# Altium project Pixel1.0_2.PrjPcb
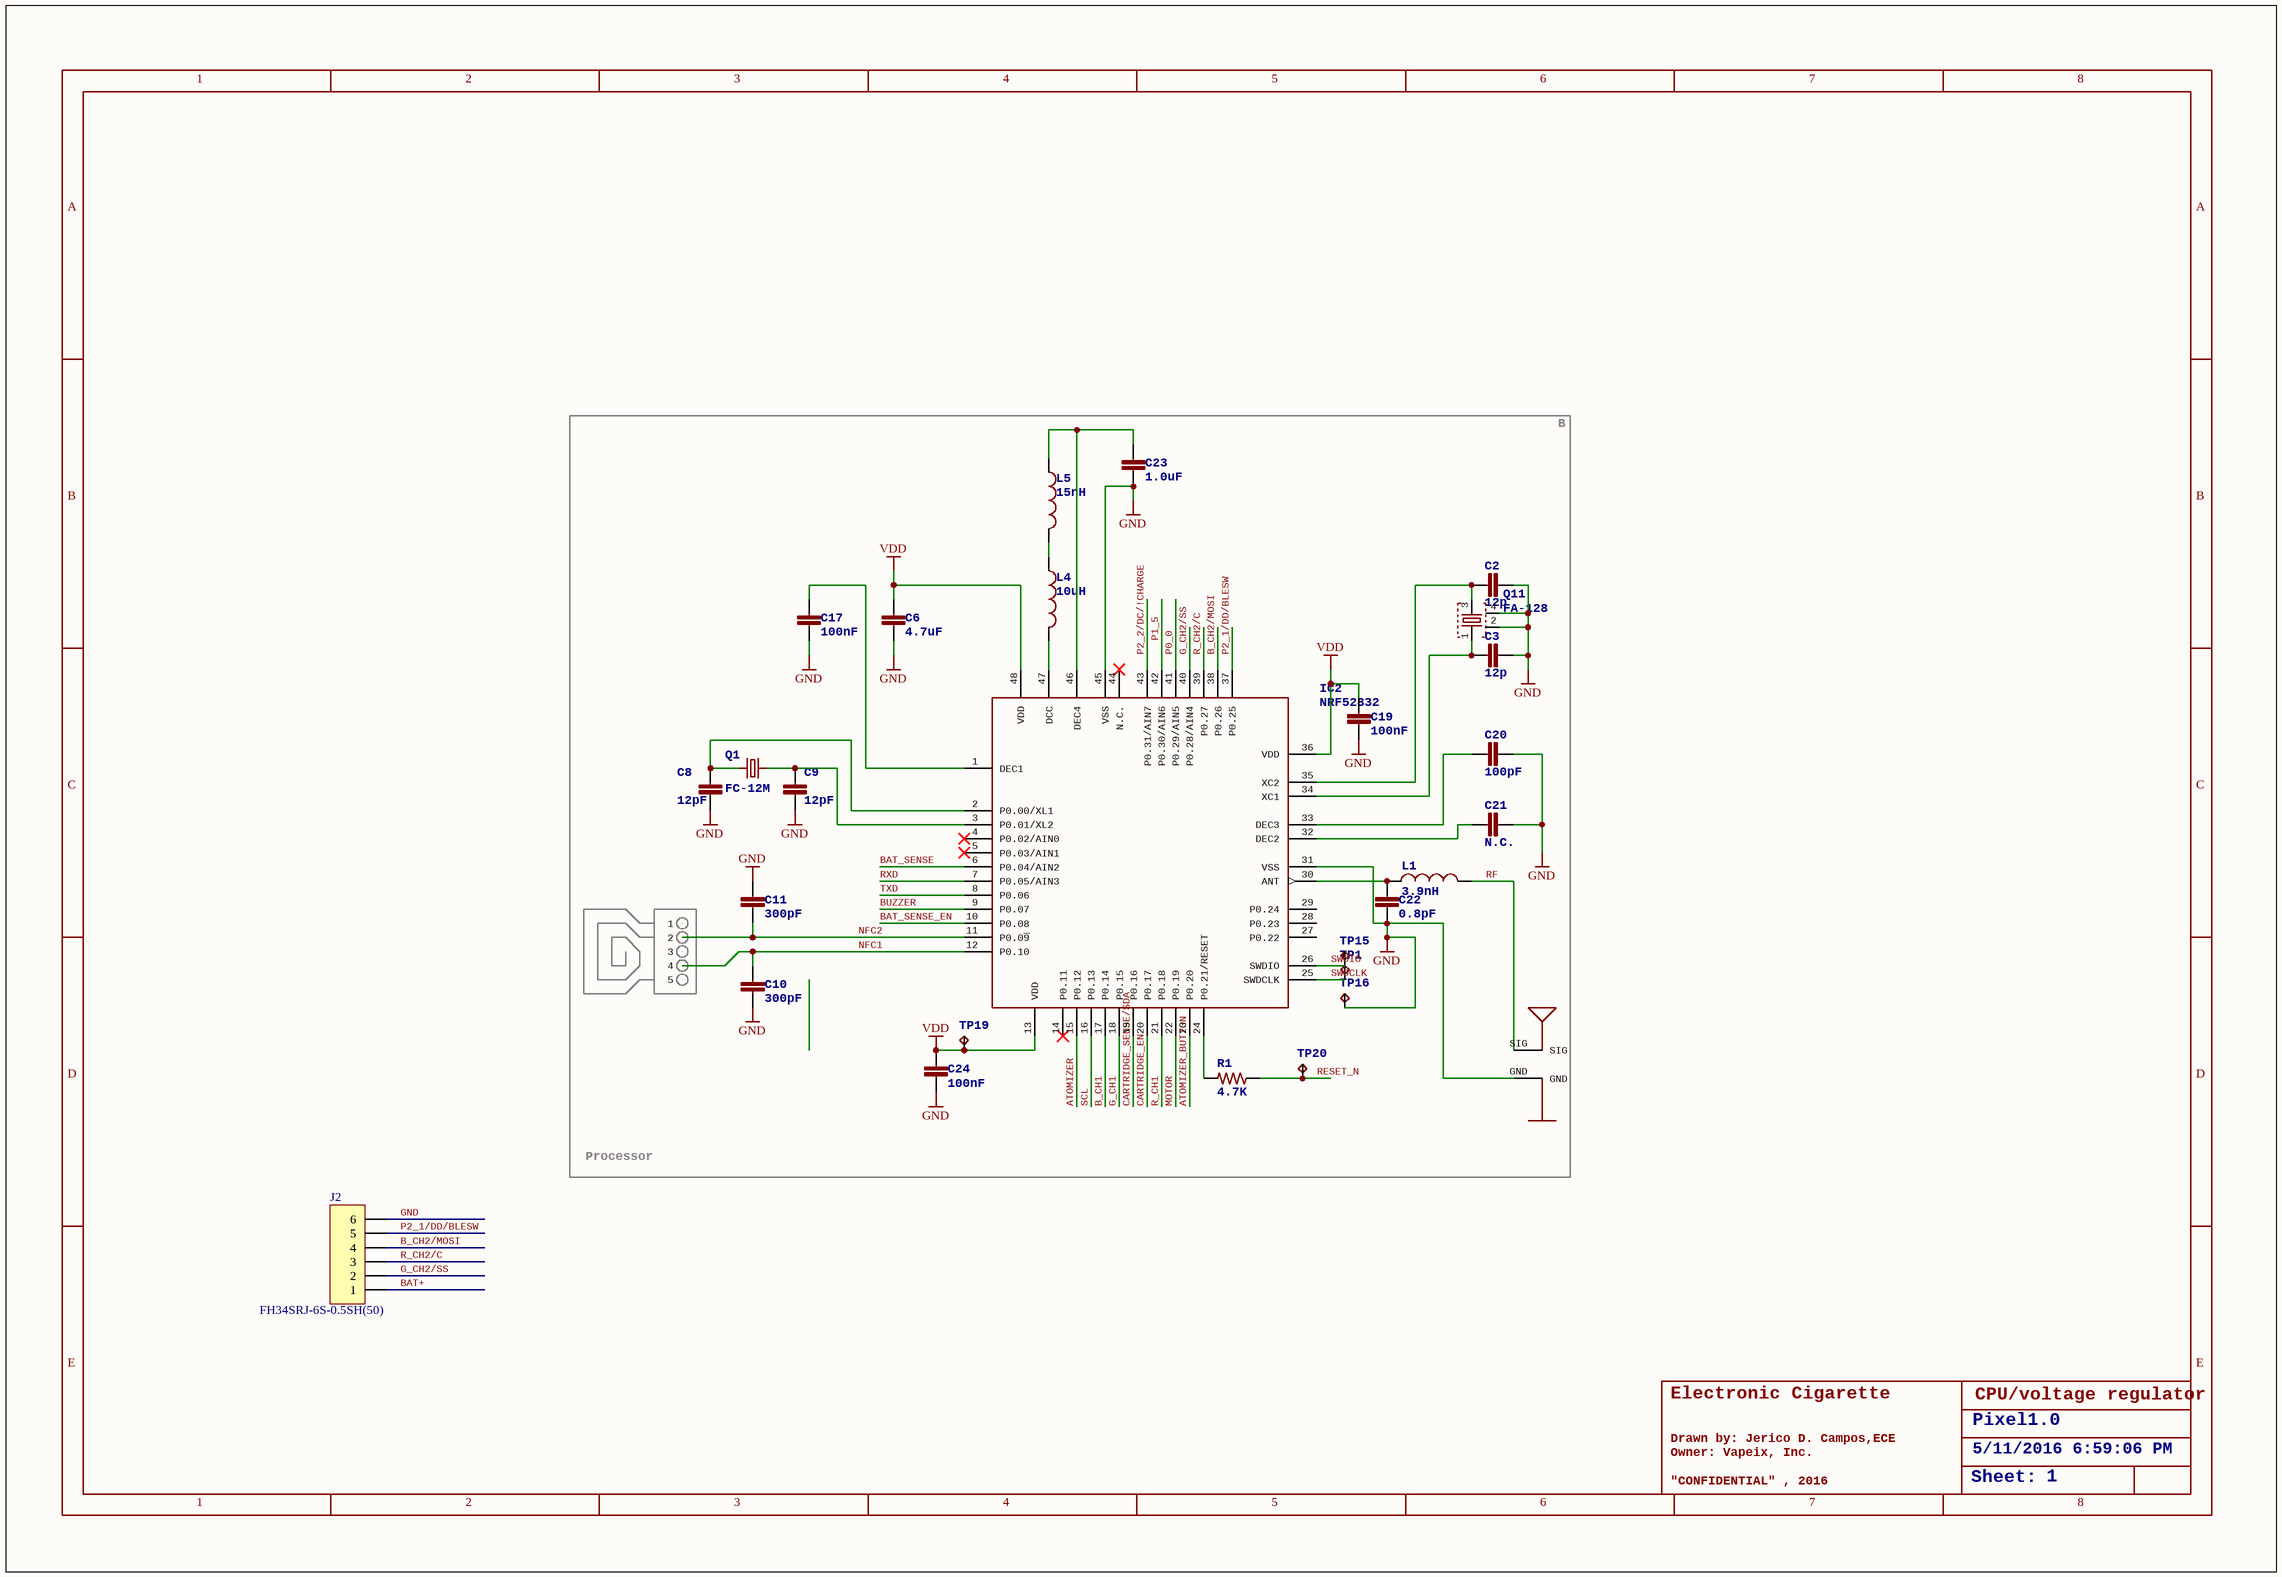
[diagram p0: Pixel1.0_0.SchDoc]
2 sheets, 82 parts. Net scope: global (net labels, ports and power ports of the same name join across sheets).
Board file: Pixel1.0_2.PcbDoc
Sheets:
  Pixel1.0_0.SchDoc
  Pixel1.0_2.SchDoc

## Sheet Pixel1.0_0.SchDoc: Pixel1.0
size 409 x 282 mm; Date: 5/11/2016 6:59:06 PM; SheetNumber: 1

### Parts
ANT  U.FL  [U.FL]  (value not drawn)
C2  12p  [C0201]
C3  12p  [C0201]
C6  4.7uF  [C0201]
C8  12pF  [C0201]
C9  12pF  [C0201]
C10  300pF  [C0201]
C11  300pF  [C0201]
C17  100nF  [C0201]
C19  100nF  [C0201]
C20  100pF  [C0201]
C21  N.C.  [C0201]
C22  0.8pF  [C0201]
C23  1.0uF  [C0201]
C24  100nF  [C0201]
IC2  NRF52832  [QFN-48]
J2  FH34SRJ-6S-0.5SH(50)  [59453061110ECHLF]
L1  3.9nH  [JE0402]
L4  10uH  [C0603]
L5  15nH  [JE0402]
Q1  FC-12M  [FC-12M]
Q11  FA-128  [FA-128]
R1  4.7K  [R0201]
TP1  TPTP06R  [TP06R]  (value not drawn)
TP15  TPTP06R  [TP06R]  (value not drawn)
TP16  TPTP06R  [TP06R]  (value not drawn)
TP19  TPTP06R  [TP06R]  (value not drawn)
TP20  TPTP06R  [TP06R]  (value not drawn)
U$2  NFCCONNECTORMOLEX_5PIN  [NFC.CONN]  (value not drawn)

### Nets
GND: ANT.GND C2.2 C3.1 C6.2 C8.2 C9.2 C10.2 C11.2 C17.2 C19.2 C20.1 C21.1 C22.2 C23.2 C24.2 IC2.31(VSS) IC2.45(VSS) J2.6 Q11.2 Q11.4 TP16.TP
VDD: C6.1 C19.1 C24.1 IC2.13(VDD) IC2.36(VDD) IC2.48(VDD) TP19.TP
ATOMIZER: IC2.15(P0.12)
ATOMIZER_BUTTON: IC2.23(P0.20)
B_CH1: IC2.17(P0.14)
B_CH2/MOSI: IC2.38(P0.26) J2.4
BAT+: J2.1
BAT_SENSE: IC2.6(P0.04/AIN2)
BAT_SENSE_EN: IC2.10(P0.08)
BUZZER: IC2.9(P0.07)
CARTRIDGE_EN: IC2.20(P0.17)
CARTRIDGE_SENSE/SDA: IC2.19(P0.16)
G_CH1: IC2.18(P0.15)
G_CH2/SS: IC2.40(P0.28/AIN4) J2.2
MOTOR: IC2.22(P0.19)
NFC1: C10.1 IC2.12(P0.10) U$2.4
NFC2: C11.1 IC2.11(P0.0~{9}) U$2.2
P0_0: IC2.41(P0.29/AIN5)
P1_5: IC2.42(P0.30/AIN6)
P2_1/DD/BLESW: IC2.37(P0.25) J2.5
P2_2/DC/!CHARGE: IC2.43(P0.31/AIN7)
R_CH1: IC2.21(P0.18)
R_CH2/C: IC2.39(P0.27) J2.3
RESET_N: R1.1 TP20.TP
RF: ANT.SIG L1.2
RXD: IC2.7(P0.05/AIN3)
SCL: IC2.16(P0.13)
SWDCLK: IC2.25(SWDCLK) TP1.TP
SWDIO: IC2.26(SWDIO) TP15.TP
TXD: IC2.8(P0.06)
NetC2_1: C2.1 IC2.35(XC2) Q11.3
NetC3_2: C3.2 IC2.34(XC1) Q11.1
NetC8_1: C8.1 IC2.2(P0.00/XL1) Q1.1
NetC9_1: C9.1 IC2.3(P0.01/XL2) Q1.2
NetC17_1: C17.1 IC2.1(DEC1)
NetC20_2: C20.2 IC2.33(DEC3)
NetC21_2: C21.2 IC2.32(DEC2)
NetC22_1: C22.1 IC2.30(ANT) L1.1
NetC23_1: C23.1 IC2.46(DEC4) L5.1
NetIC2_24: IC2.24(P0.21/RESET) R1.2
NetIC2_47: IC2.47(DCC) L4.2
NetL4_1: L4.1 L5.2

Not connected (* = marked no-connect by the designer): IC2 4(P0.02/AIN0)* 5(P0.03/AIN1)* 14(P0.11)* 27(P0.22) 28(P0.23) 29(P0.24) 44(N.C.)*; U$2 1 3 5

### Notes on the sheet
- B
- Processor
- Electronic Cigarette
- Drawn by: Jerico D. Campos,ECE
- Owner: Vapeix, Inc.
- Pixel1.0
- 5/11/2016 6:59:06 PM
- CPU/voltage regulator
- "CONFIDENTIAL" , 2016
- Sheet:
- 1
- 2
- 3
- 4
- 5
- 6
- 7
- 8
- A
- C
- D
- E

### Library data of the parts
C2 C3 C6 C8-C11 C17 C19-C24 = C-EUC0201: CAPACITOR, European symbol
J2 = WE-ZIF Connector WR-FPC 68710614522: WR-FPC 0.50mm SMT ZIF Horizontal Bottom Contact; Manufacturer: W¨¹rth Elektronik eiSos GmbH; ComponentLink1 Description: Manufacturer; ComponentLink2 Description: Datasheet; NoPins: 06; Created Date: 28 October 2013; partNo: 68710614522; ComponentLink1URL: http://www.we-online.com; ComponentLink2URL: http://katalog.we-online.de/em/datasheet/6871xx14522.pdf; Created by: Karrer Zheng
L1 L4 L5 = LBEAD
Q1 = FC-12M: kHz RANGE CRYSTAL UNIT   LOW PROFILE SMDSource: Epson Toyocom FC-12M.pdf
Q11 = FA-128: MHz RANGE CRYSTAL UNIT    Source: Epson Toyocom
R1 = R-US_R0201: RESISTOR, American symbol
TP1 TP15 TP16 TP19 TP20 = TPTP06R: Test pad

## Sheet Pixel1.0_2.SchDoc: Pixel1.0
size 409 x 282 mm; Date: 5/11/2016 6:59:09 PM; SheetNumber: 3
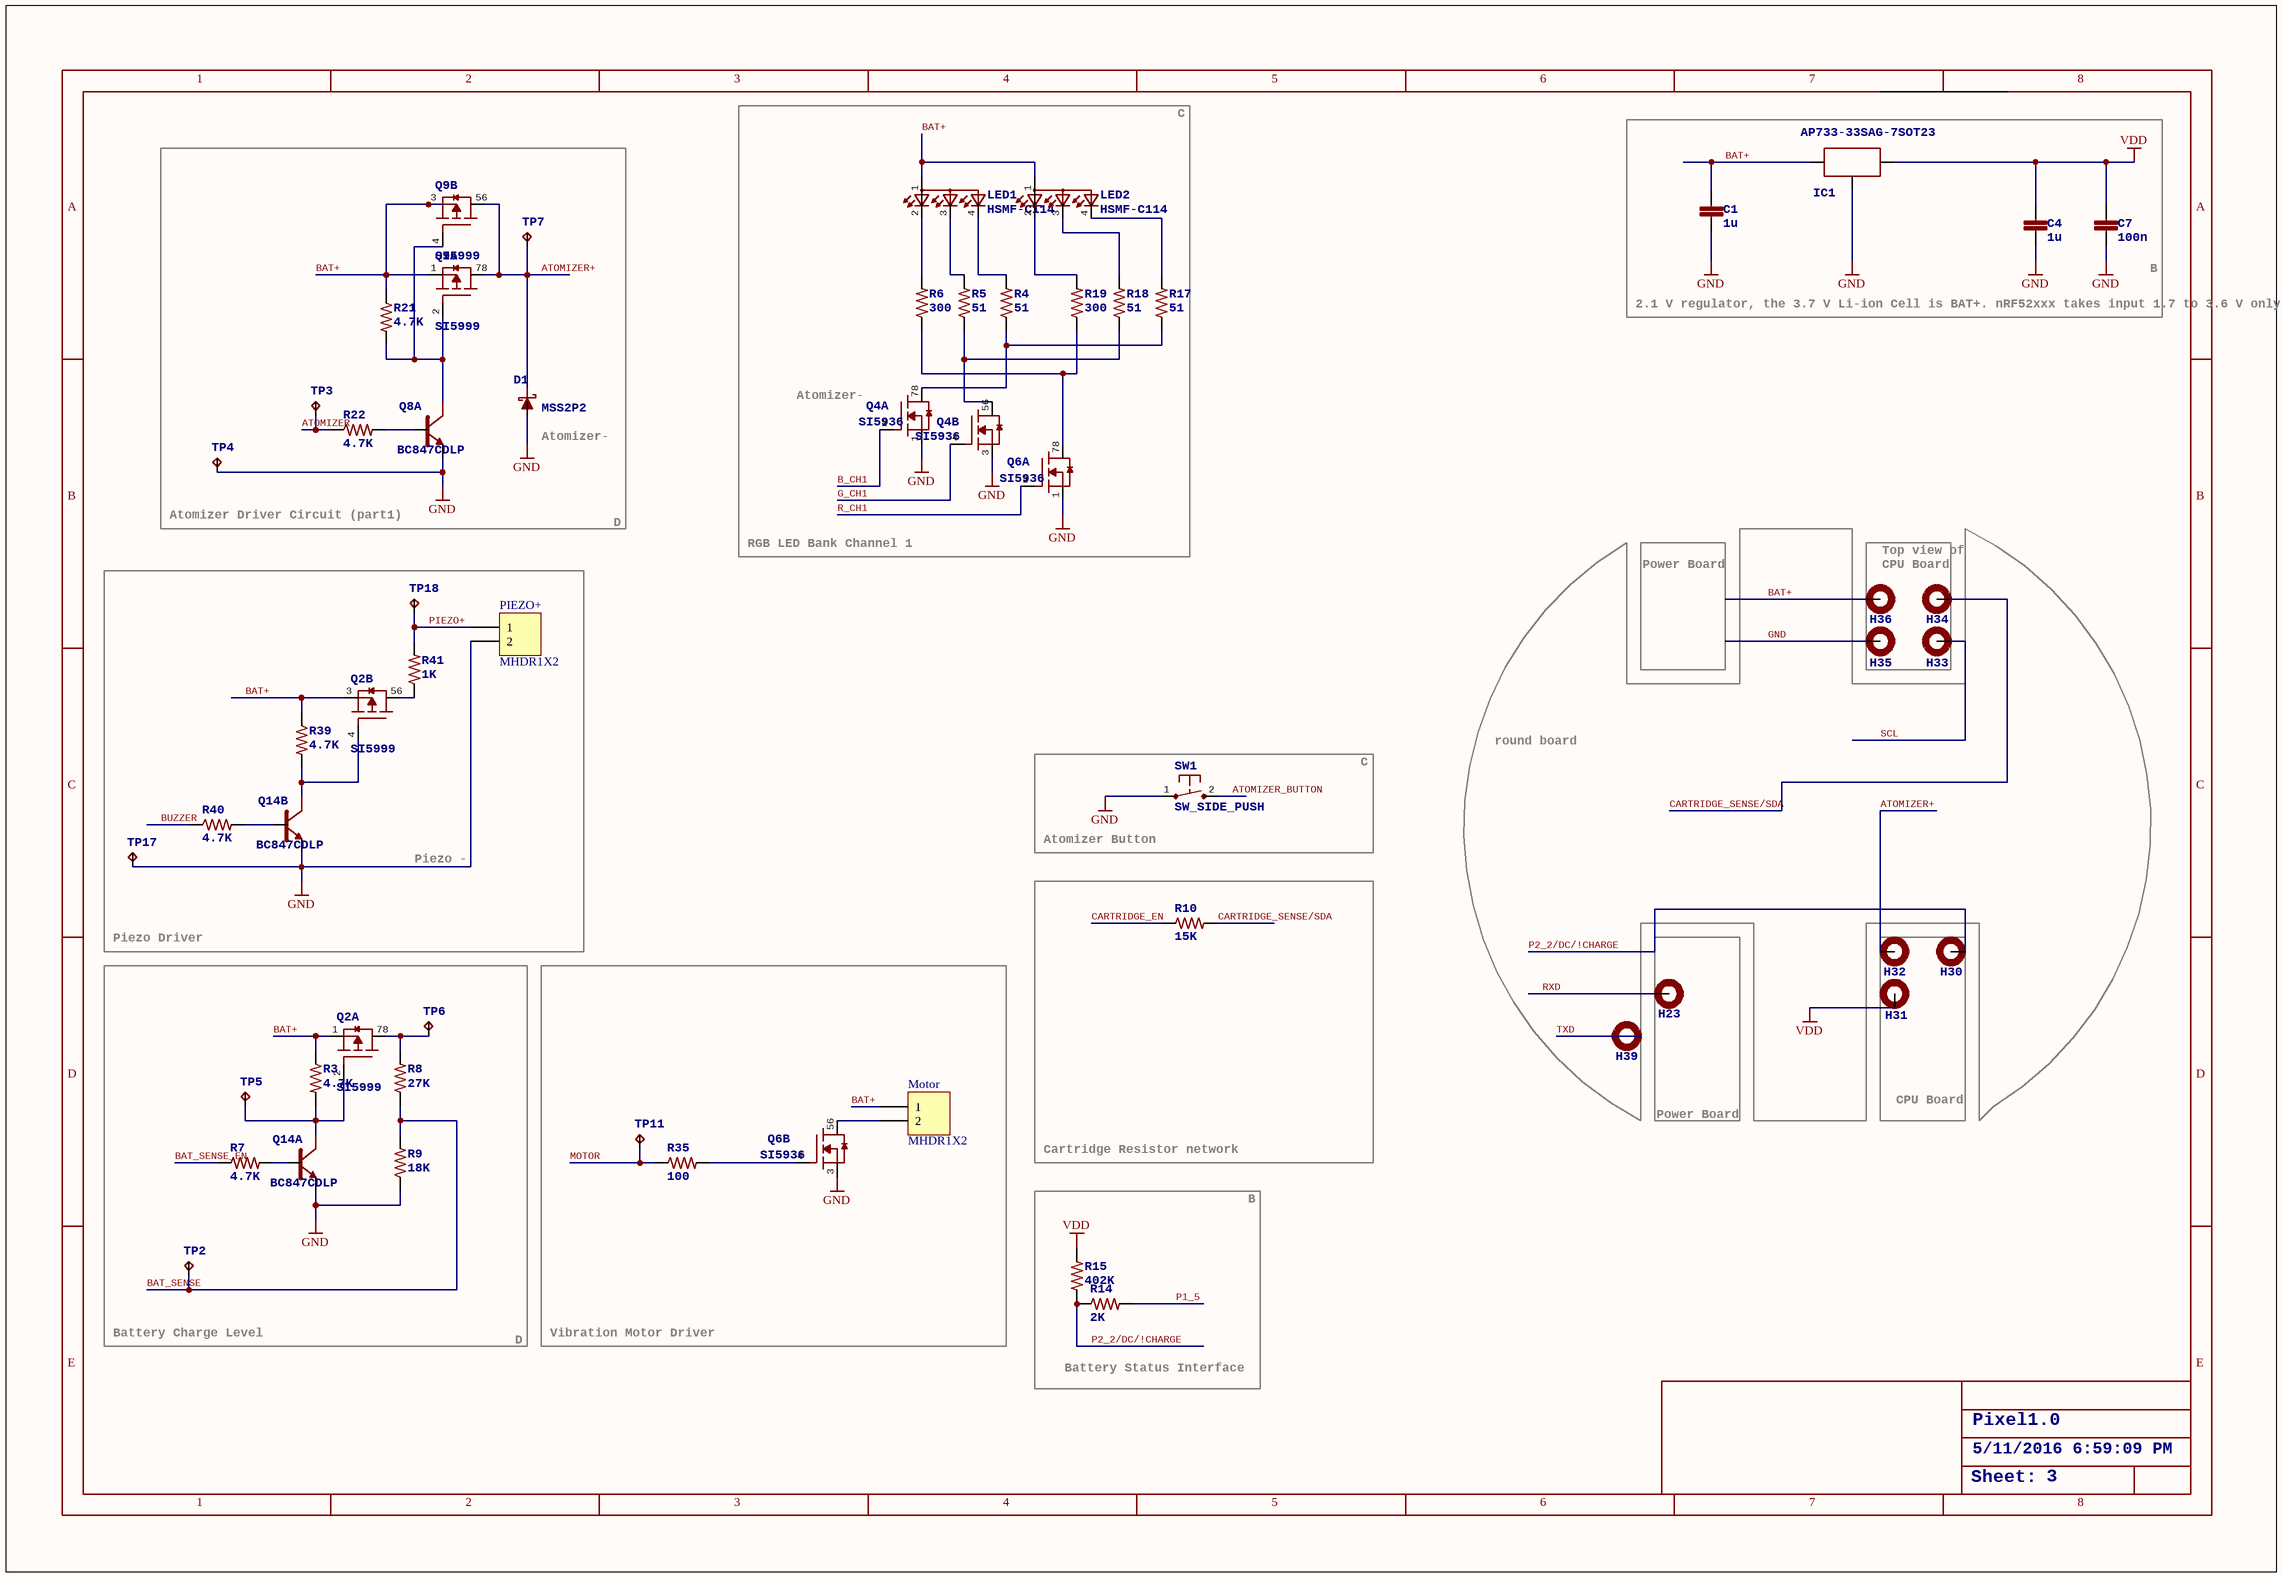
[diagram p1: Pixel1.0_2.SchDoc]

### Parts
C1  1u  [C0603]
C4  1u  [C0603]
C7  100n  [C0603]
D1  MSS2P2  [MICROSMP]
H23  MOUNT-PAD-ROUND1.5MMX1MM  [TMOUNT4]  (value not drawn)
H30  MOUNT-PAD-ROUNDTMOUNT1  [T-MOUNT1]  (value not drawn)
H31  MOUNT-PAD-ROUNDTMOUNT1  [T-MOUNT1]  (value not drawn)
H32  MOUNT-PAD-ROUNDTMOUNT1  [T-MOUNT1]  (value not drawn)
H33  MOUNT-PAD-ROUNDTMOUNT1  [T-MOUNT1]  (value not drawn)
H34  MOUNT-PAD-ROUNDTMOUNT1  [T-MOUNT1]  (value not drawn)
H35  MOUNT-PAD-ROUNDTMOUNT1  [T-MOUNT1]  (value not drawn)
H36  MOUNT-PAD-ROUNDTMOUNT1  [T-MOUNT1]  (value not drawn)
H39  MOUNT-PAD-ROUND1.5MMX1MM  [TMOUNT4]  (value not drawn)
IC1  AP733-33SAG-7SOT23  [SOT23]
LED1  HSMF-C114  [HSMFC114]
LED2  HSMF-C114  [HSMFC114]
Motor  MHDR1X2  [MHDR1X2]
PIEZO+  MHDR1X2  [MHDR1X2]
Q2  SI5999  [1206-8CHIP-FET]  (parts A,B of 2)
Q4  SI5936  [1206-8CHIP-FET]  (parts A,B of 2)
Q6  SI5936  [1206-8CHIP-FET]  (parts A,B of 2)
Q8  BC847CDLP  [X2-DFN1310-6]  (part A of 2)
Q9  SI5999  [1206-8CHIP-FET]  (parts A,B of 2)
Q14  BC847CDLP  [X2-DFN1310-6]  (parts A,B of 2)
R3  4.7K  [R0201]
R4  51  [R0201]
R5  51  [R0201]
R6  300  [R0201]
R7  4.7K  [R0201]
R8  27K  [R0201]
R9  18K  [R0201]
R10  15K  [R0201]
R14  2K  [R0201]
R15  402K  [R0201]
R17  51  [R0201]
R18  51  [R0201]
R19  300  [R0201]
R21  4.7K  [R0201]
R22  4.7K  [R0201]
R35  100  [R0201]
R39  4.7K  [R0201]
R40  4.7K  [R0201]
R41  1K  [R0201]
SW1  SW_SIDE_PUSH  [SW1]
TP2  TPTP06R  [TP06R]  (value not drawn)
TP3  TPTP06R  [TP06R]  (value not drawn)
TP4  TPTP06R  [TP06R]  (value not drawn)
TP5  TPTP06R  [TP06R]  (value not drawn)
TP6  TPTP06R  [TP06R]  (value not drawn)
TP7  TPTP06R  [TP06R]  (value not drawn)
TP11  TPTP06R  [TP06R]  (value not drawn)
TP17  TPTP06R  [TP06R]  (value not drawn)
TP18  TPTP06R  [TP06R]  (value not drawn)

### Blocks framed on the sheet
B: C1 C4 C7 IC1
Cartridge Resistor network: R10
Vibration Motor Driver: Motor Q6 R35 TP11
Power Board: H23
CPU Board: H30-H32

### Nets
GND: C1.1 C4.1 C7.1 D1.A H35.1(MOUNT) IC1.3(GND) PIEZO+.2 Q4.1(S1) Q4.3(S2) Q6.1(S1) Q6.3(S2) Q8.E1(E) Q14.E1(E) Q14.E2(E) R9.1 SW1.1(P) TP4.TP TP17.TP
VDD: C4.2 C7.2 H31.1(MOUNT) IC1.2(OUT) R15.1
ATOMIZER: R22.1 TP3.TP
ATOMIZER+: D1.K H32.1(MOUNT) Q9.56(D2) Q9.78(D1) TP7.TP
ATOMIZER_BUTTON: SW1.2(S)
B_CH1: Q4.2(G1)
BAT+: C1.2 H36.1(MOUNT) IC1.1(IN) LED1.1(A) LED2.1(A) Motor.1 Q2.1(S1) Q2.3(S2) Q9.1(S1) Q9.3(S2) R3.1 R21.1 R39.1
BAT_SENSE: R8.1 R9.2 TP2.TP
BAT_SENSE_EN: R7.1
BUZZER: R40.1
CARTRIDGE_EN: R10.1
CARTRIDGE_SENSE/SDA: H34.1(MOUNT) R10.2
G_CH1: Q4.4(G2)
MOTOR: R35.1 TP11.TP
P1_5: R14.2
P2_2/DC/!CHARGE: H30.1(MOUNT) R14.1 R15.2
PIEZO+: PIEZO+.1 R41.2 TP18.TP
R_CH1: Q6.2(G1)
RXD: H23.1(MOUNT)
SCL: H33.1(MOUNT)
TXD: H39.1(MOUNT)
NetLED1_2: LED1.2(RED) R6.2
NetLED1_3: LED1.3(GREEN) R5.2
NetLED1_4: LED1.4(BLUE) R4.2
NetLED2_2: LED2.2(RED) R19.2
NetLED2_3: LED2.3(GREEN) R18.2
NetLED2_4: LED2.4(BLUE) R17.2
NetMotor_2: Motor.2 Q6.56(D2)
NetQ2_2: Q2.2(G1) Q14.C1(C) R3.2 TP5.TP
NetQ2_4: Q2.4(G2) Q14.C2(C) R39.2
NetQ2_56: Q2.56(D2) R41.1
NetQ2_78: Q2.78(D1) R8.2 TP6.TP
NetQ4_56: Q4.56(D2) R5.1 R18.1
NetQ4_78: Q4.78(D1) R4.1 R17.1
NetQ6_4: Q6.4(G2) R35.2
NetQ6_78: Q6.78(D1) R6.1 R19.1
NetQ8_B1: Q8.B1(B) R22.2
NetQ8_C1: Q8.C1(C) Q9.2(G1) Q9.4(G2) R21.2
NetQ14_B1: Q14.B1(B) R7.2
NetQ14_B2: Q14.B2(B) R40.2

### Notes on the sheet
- C
- 2.1 V regulator, the 3.7 V Li-ion Cell is BAT+. nRF52xxx takes input 1.7 to 3.6 V only.
- (near Q4) Atomizer-
- (near D1) Atomizer-
- Atomizer Driver Circuit (part1)
- D
- RGB LED Bank Channel 1
- Power Board
- Top view of
- CPU Board
- round board
- Piezo -
- (near SW1) Atomizer Button
- Piezo Driver
- B
- Battery Charge Level
- Battery Status Interface
- Pixel1.0
- 5/11/2016 6:59:09 PM
- Sheet:
- 3
- 1
- 2
- 4
- 5
- 6
- 7
- 8
- A
- E

### Library data of the parts
C1 C4 C7 = C-EUC0603: CAPACITOR, European symbol
H23 H39 = MOUNT-PAD-ROUND1.5MMX1MM: MOUNTING PAD, round
H30-H36 = MOUNT-PAD-ROUNDTMOUNT1: MOUNTING PAD, round
LED1 LED2 = HSMF-C114: Chip LED RGB   Source: http://document.sharpsma.com/files/GM1WA55311A_SS.pdf
Motor PIEZO+ = MHDR1X2: Header, 2-Pin; LatestRevisionDate: 17-Jul-2002; LatestRevisionNote: Re-released for DXP Platform.; Publisher: Altium Limited
Q2 Q9 = SI5999: Dual N-Channel 30-V (D-S) MOSFET   Source: http://www.vishay.com/docs/71053/71053.pdf
Q8 Q14 = BC847CDLP: http://www.diodes.com/datasheets/ds30817.pdf
R3-R10 R14 R15 R17-R19 R21 R22 R35 R39-R41 = R-US_R0201: RESISTOR, American symbol
TP2-TP7 TP11 TP17 TP18 = TPTP06R: Test pad

## Nets that join several sheets
GND: Pixel1.0_0 (21 pins), Pixel1.0_2 (18 pins)
VDD: Pixel1.0_0 (7 pins), Pixel1.0_2 (5 pins)
ATOMIZER: Pixel1.0_0 (IC2.15), Pixel1.0_2 (R22.1 TP3.TP)
ATOMIZER_BUTTON: Pixel1.0_0 (IC2.23), Pixel1.0_2 (SW1.2)
B_CH1: Pixel1.0_0 (IC2.17), Pixel1.0_2 (Q4.2)
BAT+: Pixel1.0_0 (J2.1), Pixel1.0_2 (13 pins)
BAT_SENSE: Pixel1.0_0 (IC2.6), Pixel1.0_2 (R8.1 R9.2 TP2.TP)
BAT_SENSE_EN: Pixel1.0_0 (IC2.10), Pixel1.0_2 (R7.1)
BUZZER: Pixel1.0_0 (IC2.9), Pixel1.0_2 (R40.1)
CARTRIDGE_EN: Pixel1.0_0 (IC2.20), Pixel1.0_2 (R10.1)
CARTRIDGE_SENSE/SDA: Pixel1.0_0 (IC2.19), Pixel1.0_2 (H34.1 R10.2)
G_CH1: Pixel1.0_0 (IC2.18), Pixel1.0_2 (Q4.4)
MOTOR: Pixel1.0_0 (IC2.22), Pixel1.0_2 (R35.1 TP11.TP)
P1_5: Pixel1.0_0 (IC2.42), Pixel1.0_2 (R14.2)
P2_2/DC/!CHARGE: Pixel1.0_0 (IC2.43), Pixel1.0_2 (H30.1 R14.1 R15.2)
R_CH1: Pixel1.0_0 (IC2.21), Pixel1.0_2 (Q6.2)
RXD: Pixel1.0_0 (IC2.7), Pixel1.0_2 (H23.1)
SCL: Pixel1.0_0 (IC2.16), Pixel1.0_2 (H33.1)
TXD: Pixel1.0_0 (IC2.8), Pixel1.0_2 (H39.1)